# EAGLE schematic DELTA_7_25_2016 (EAGLE 6.3), part 2 of 2
## Sheet 8 of 13
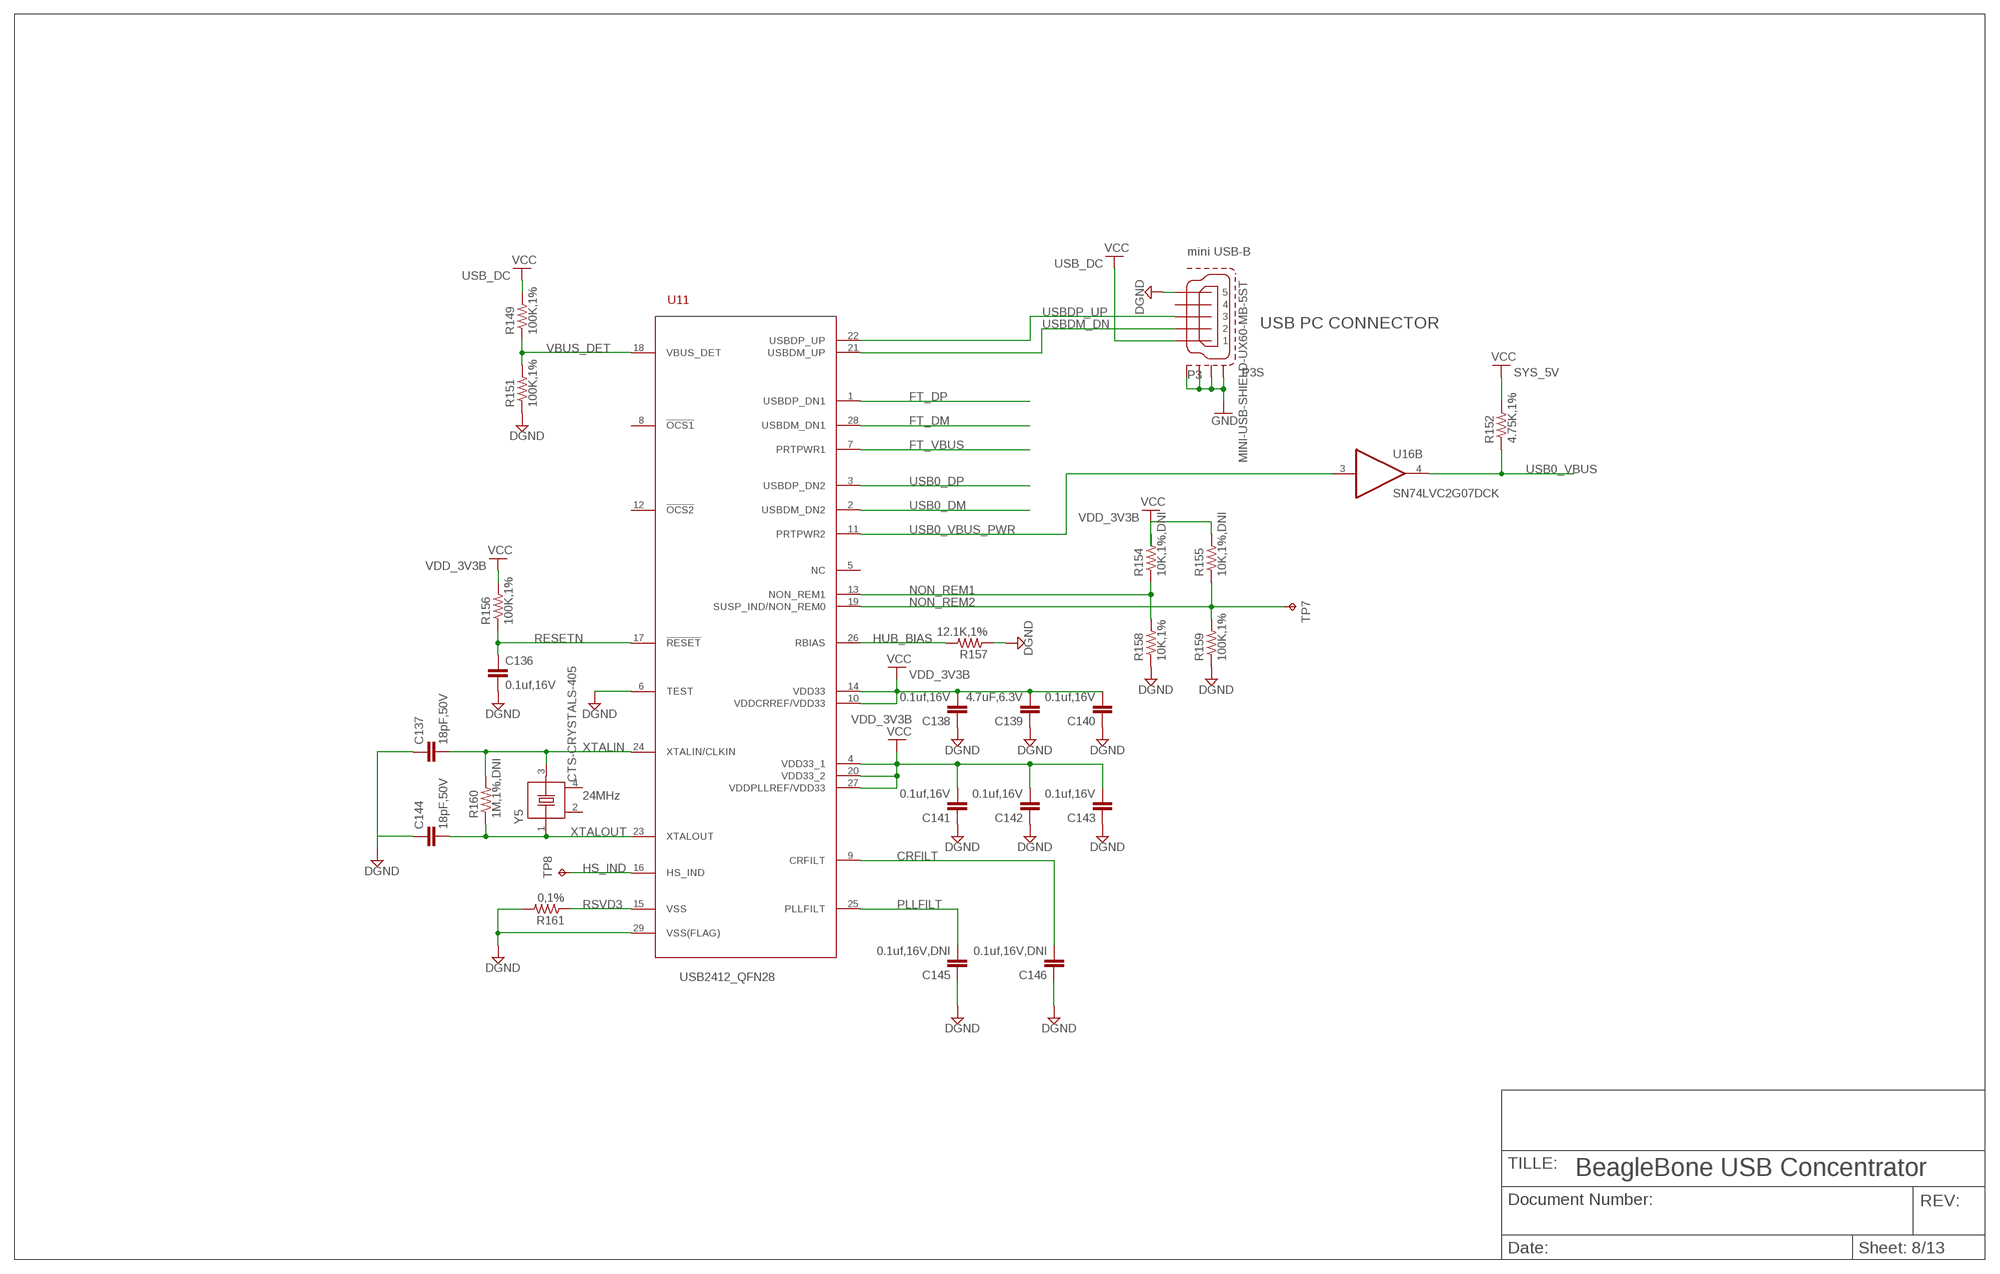
[diagram p9: schematic, sheet 8]

### Parts
C136  0.1uf,16V  CAPC402  [C402]
C137  18pF,50V  CAPC402  [C402]
C138  0.1uf,16V  CAPC402  [C402]
C139  4.7uF,6.3V  CAPC402  [C402]
C140  0.1uf,16V  CAPC402  [C402]
C141  0.1uf,16V  CAPC402  [C402]
C142  0.1uf,16V  CAPC402  [C402]
C143  0.1uf,16V  CAPC402  [C402]
C144  18pF,50V  CAPC402  [C402]
C145  0.1uf,16V,DNI  CAPC805  [C805]
C146  0.1uf,16V,DNI  CAPC805  [C805]
P3  MINI-USB-SHIELD-UX60-MB-5ST  [UX60-MB-5ST]
R149  100K,1%  R-US_R0402  [R0402]
R151  100K,1%  R-US_R0402  [R0402]
R152  4.75K,1%  R-US_R0402  [R0402]
R154  10K,1%,DNI  R-US_R0402  [R0402]
R155  10K,1%,DNI  R-US_R0402  [R0402]
R156  100K,1%  R-US_R0402  [R0402]
R157  12.1K,1%  R-US_R0402  [R0402]
R158  10K,1%  R-US_R0402  [R0402]
R159  100K,1%  R-US_R0402  [R0402]
R160  1M,1%,DNI  R-US_R0402  [R0402]
R161  0,1%  R-US_R0402  [R0402]
TP7  TPB1,27  [B1,27]
TP8  TPB1,27  [B1,27]
U11  USB2412_QFN28  [QFN28]
U16  SN74LVC2G07DCK  [DCK(R-PDSO-G6)]
Y5  CTS-CRYSTALS-405  [CTS-405]

### Nets
CRFILT: C146.2 U11.9(CRFILT)
DGND: C136.2 C137.1 C138.1 C139.1 C140.1 C141.1 C142.1 C143.1 C144.1 C145.1 C146.1 P3.5 R151.1 R157.1 R158.1 R159.1 R161.2 U11.6(TEST) U11.29(VSS(FLAG)) ; also sheet 1,2,3,5,6,7,9,10,11,12,13
FT_DM: U11.28(USBDM_DN1) ; also sheet 9
FT_DP: U11.1(USBDP_DN1) ; also sheet 9
FT_VBUS: U11.7(PRTPWR1) ; also sheet 9
GND: P3.M1(S1) P3.M2(S2) P3.M3(S3) P3.M4(S4) ; also sheet 1,7,10,11
HS_IND: TP8.TP U11.16(HS_IND)
HUB_BIAS: R157.2 U11.26(RBIAS)
NON_REM1: R154.1 R158.2 U11.13(NON_REM1)
NON_REM2: R155.1 R159.2 TP7.TP U11.19(SUSP_IND/NON_REM0)
PLLFILT: C145.2 U11.25(PLLFILT)
RESETN: C136.1 R156.1 U11.17(!RESET)
RSVD3: R161.1 U11.15(VSS)
SYS_5V: R152.2 ; supply symbol labelled VCC ; also sheet 1,5,7,10,11
USB0_DM: U11.2(USBDM_DN2) ; also sheet 4
USB0_DP: U11.3(USBDP_DN2) ; also sheet 4
USB0_VBUS: R152.1 U16.4(B:O) ; also sheet 4
USB0_VBUS_PWR: U11.11(PRTPWR2) U16.3(B:I)
USB_DC: P3.1 R149.2 ; supply symbol labelled VCC ; also sheet 1
USBDM_DN: P3.2 U11.21(USBDM_UP)
USBDP_UP: P3.3 U11.22(USBDP_UP)
VBUS_DET: R149.1 R151.2 U11.18(VBUS_DET)
VDD_3V3B: C138.2 C139.2 C140.2 C141.2 C142.2 C143.2 R155.2 R156.2 U11.4(VDD33_1) U11.10(VDDCRREF/VDD33) U11.14(VDD33) U11.20(VDD33_2) U11.27(VDDPLLREF/VDD33) ; supply symbol labelled VCC ; also sheet 1,4,6,7,9,10,11,13
XTALIN: C137.2 R160.2 U11.24(XTALIN/CLKIN) Y5.3
XTALOUT: C144.2 R160.1 U11.23(XTALOUT) Y5.1
Unconnected: P3.4 R154.2 U11.5(NC) U11.8(!OCS1) U11.12(!OCS2) Y5.2 Y5.4

### Notes on the sheet
- mini USB-B
- USB PC CONNECTOR
- 24MHz
- TILLE:
- BeagleBone USB Concentrator
- Document Number: | REV:
- Date: | Sheet: 8/13

## Sheet 9 of 13
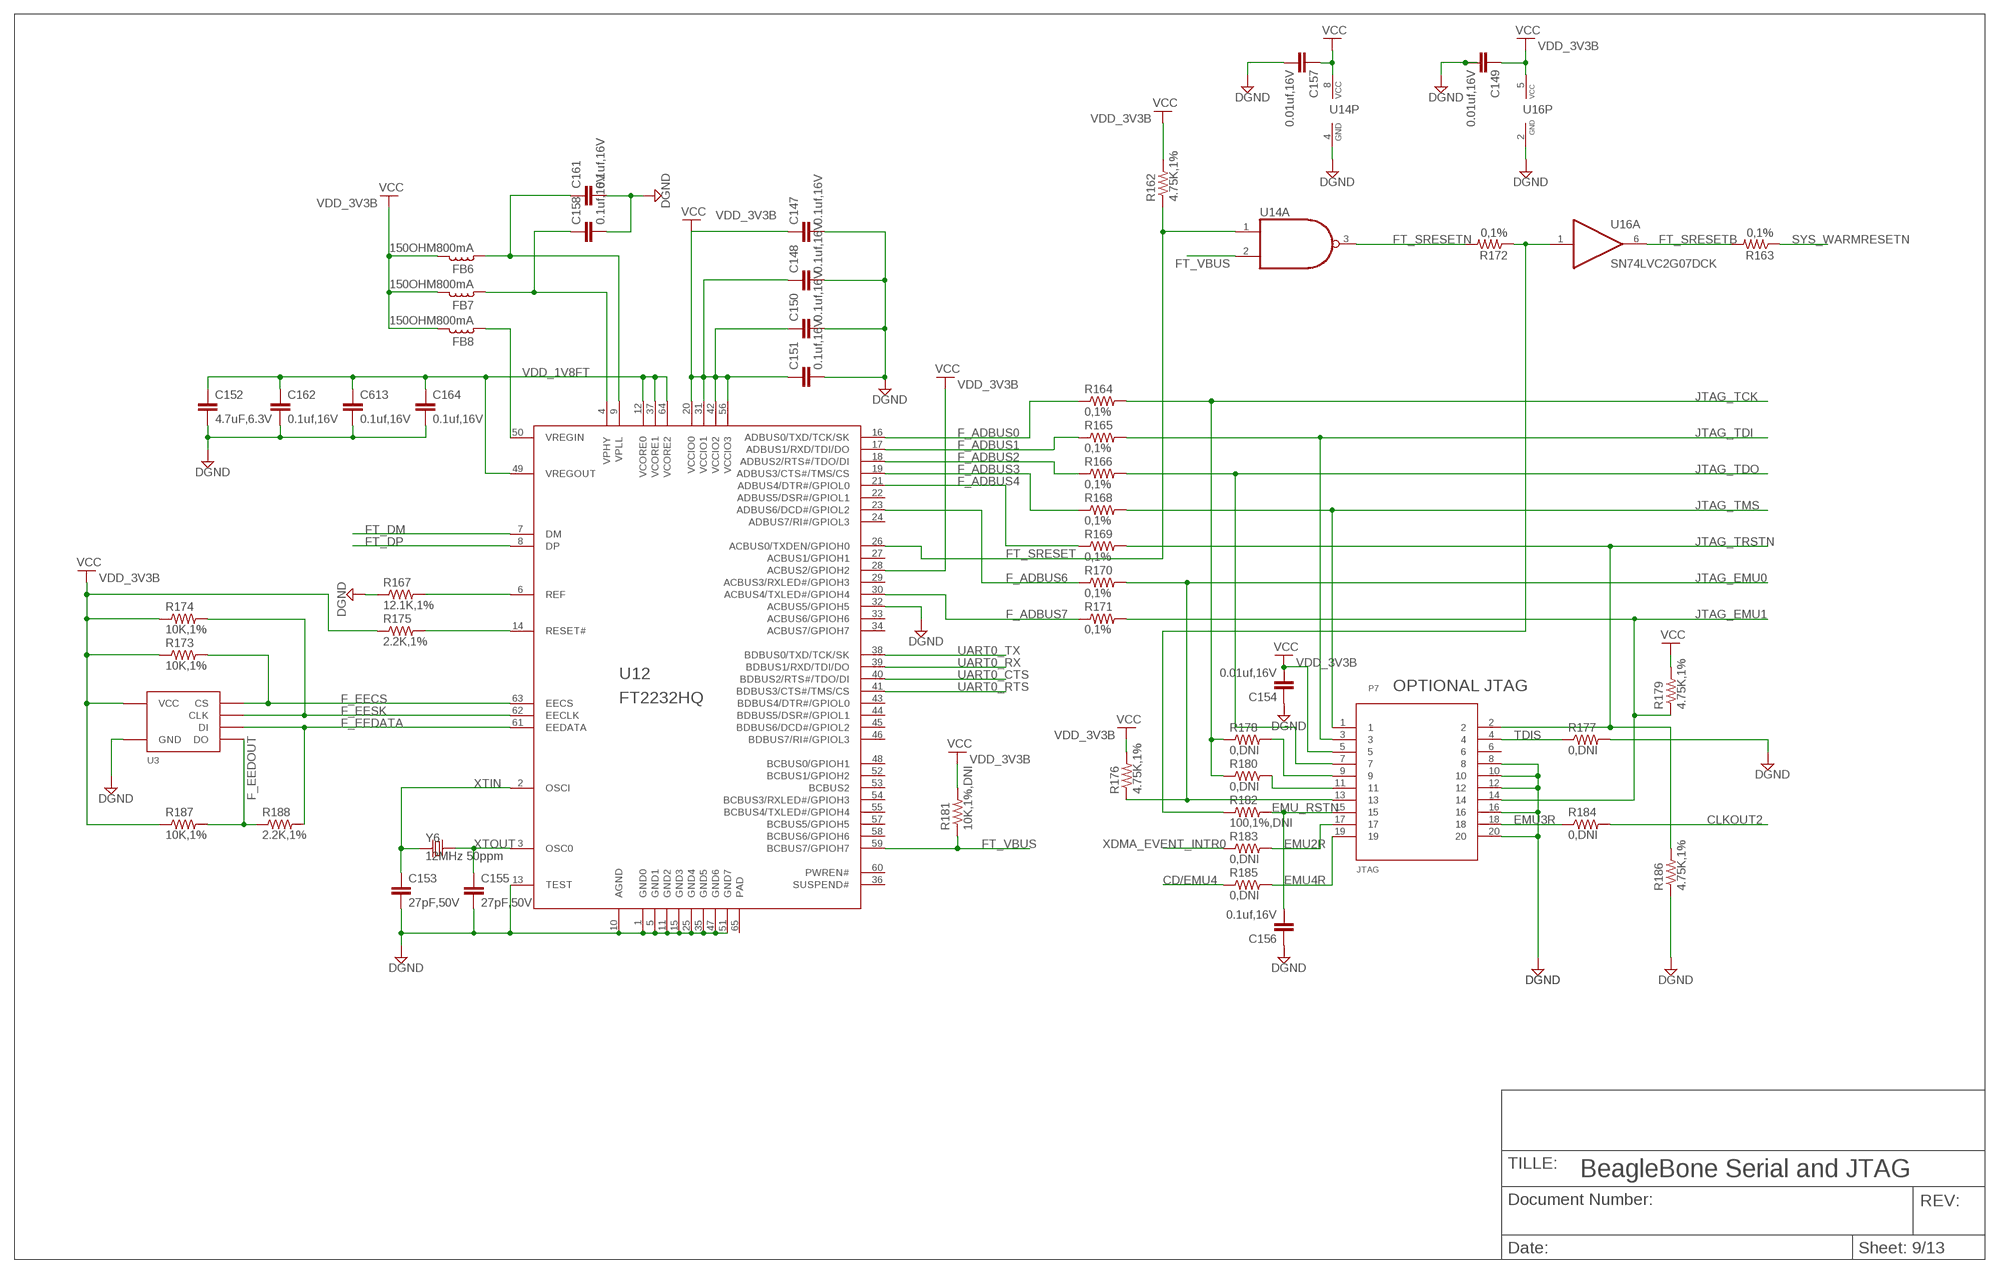
[diagram p10: schematic, sheet 9]

### Parts
C147  0.1uf,16V  CAPC402  [C402]
C148  0.1uf,16V  CAPC402  [C402]
C149  0.01uf,16V  CAPC402  [C402]
C150  0.1uf,16V  CAPC402  [C402]
C151  0.1uf,16V  CAPC402  [C402]
C152  4.7uF,6.3V  CAPC402  [C402]
C153  27pF,50V  CAPC402  [C402]
C154  0.01uf,16V  CAPC402  [C402]
C155  27pF,50V  CAPC402  [C402]
C156  0.1uf,16V  CAPC402  [C402]
C157  0.01uf,16V  CAPC402  [C402]
C158  0.1uf,16V  CAPC402  [C402]
C161  0.1uf,16V  CAPC402  [C402]
C162  0.1uf,16V  CAPC402  [C402]
C164  0.1uf,16V  CAPC402  [C402]
C613  0.1uf,16V  CAPC402  [C402]
FB6  150OHM800mA  L-USL0603  [L0603]
FB7  150OHM800mA  L-USL0603  [L0603]
FB8  150OHM800mA  L-USL0603  [L0603]
P7  JTAG  [MOLEX_79109-1004]
R162  4.75K,1%  R-US_R0402  [R0402]
R163  0,1%  R-US_R0402  [R0402]
R164  0,1%  R-US_R0402  [R0402]
R165  0,1%  R-US_R0402  [R0402]
R166  0,1%  R-US_R0402  [R0402]
R167  12.1K,1%  R-US_R0402  [R0402]
R168  0,1%  R-US_R0402  [R0402]
R169  0,1%  R-US_R0402  [R0402]
R170  0,1%  R-US_R0402  [R0402]
R171  0,1%  R-US_R0402  [R0402]
R172  0,1%  R-US_R0402  [R0402]
R173  10K,1%  R-US_R0402  [R0402]
R174  10K,1%  R-US_R0402  [R0402]
R175  2.2K,1%  R-US_R0402  [R0402]
R176  4.75K,1%  R-US_R0402  [R0402]
R177  0,DNI  R-US_R0402  [R0402]
R178  0,DNI  R-US_R0402  [R0402]
R179  4.75K,1%  R-US_R0402  [R0402]
R180  0,DNI  R-US_R0402  [R0402]
R181  10K,1%,DNI  R-US_R0402  [R0402]
R182  100,1%,DNI  R-US_R0402  [R0402]
R183  0,DNI  R-US_R0402  [R0402]
R184  0,DNI  R-US_R0402  [R0402]
R185  0,DNI  R-US_R0402  [R0402]
R186  4.75K,1%  R-US_R0402  [R0402]
R187  10K,1%  R-US_R0402  [R0402]
R188  2.2K,1%  R-US_R0402  [R0402]
U3  (EEPROM)93C46BT-I/OT  [SOT-23-6]
U12  FT2232HQ  FT2232H  [QFN64-HQ]
Y6  12MHz 50ppm  CRYSTAL_28M_  [5X8]

### Nets
CD/EMU4: R185.1 ; also sheet 4,10
CLKOUT2: R184.2 ; also sheet 3,10
DGND: C147.2 C148.2 C149.2 C150.2 C151.2 C152.2 C153.2 C154.1 C155.2 C156.1 C157.2 C158.2 C161.2 C162.2 C164.2 C613.2 P7.8 P7.10 P7.12 P7.16 P7.20 R167.1 R177.2 R186.1 U3.2(GND) U12.1(GND0) U12.5(GND1) U12.10(AGND) U12.11(GND2) U12.13(TEST) U12.15(GND3) U12.25(GND4) U12.32(ACBUS5/GPIOH5) U12.35(GND5) U12.47(GND6) U12.51(GND7) U14.4(P:GND) U16.2(P:GND) ; also sheet 1,2,3,5,6,7,8,10,11,12,13
EMU2R: P7.17 R183.2
EMU3R: P7.18 R184.1
EMU4R: P7.19 R185.2
EMU_RSTN: C156.2 P7.15 R182.2
F_ADBUS0: R164.1 U12.16(ADBUS0/TXD/TCK/SK)
F_ADBUS1: R165.1 U12.17(ADBUS1/RXD/TDI/DO)
F_ADBUS2: R166.1 U12.18(ADBUS2/RTS#/TDO/DI)
F_ADBUS3: R168.1 U12.19(ADBUS3/CTS#/TMS/CS)
F_ADBUS4: R169.1 U12.21(ADBUS4/DTR#/GPIOL0)
F_ADBUS6: R170.1 U12.23(ADBUS6/DCD#/GPIOL2)
F_ADBUS7: R171.1 U12.30(ACBUS4/TXLED#/GPIOH4)
F_EECS: R173.2 U3.5(CS) U12.63(EECS)
F_EEDATA: R188.2 U3.3(DI) U12.61(EEDATA)
F_EEDOUT: R187.2 R188.1 U3.1(DO)
F_EESK: R174.2 U3.4(CLK) U12.62(EECLK)
FT_DM: U12.7(DM) ; also sheet 8
FT_DP: U12.8(DP) ; also sheet 8
FT_SRESET: R162.1 U12.26(ACBUS0/TXDEN/GPIOH0) U14.1(A:I0)
FT_SRESETB: R163.2 U16.6(A:O)
FT_SRESETN: R172.2 U14.3(A:O)
FT_VBUS: R181.1 U12.59(BCBUS7/GPIOH7) U14.2(A:I1) ; also sheet 8
JTAG_EMU0: P7.13 R170.2 R176.1 ; also sheet 3
JTAG_EMU1: P7.14 R171.2 R179.1 ; also sheet 3
JTAG_TCK: R164.2 R178.1 R180.1 ; also sheet 3
JTAG_TDI: P7.3 R165.2 ; also sheet 3
JTAG_TDO: P7.7 R166.2 ; also sheet 3
JTAG_TMS: P7.1 R168.2 ; also sheet 3
JTAG_TRSTN: P7.2 R169.2 R186.2 ; also sheet 3
N$1: R167.2 U12.6(REF)
N$2: FB8.2 U12.50(VREGIN)
N$3: C158.1 FB7.2 U12.4(VPHY)
N$4: C161.1 FB6.2 U12.9(VPLL)
N$8: R175.2 U12.14(RESET#)
N$9: P7.11 R180.2
N$10: P7.9 R178.2
N$22: R172.1 R182.1 U16.1(A:I)
SYS_WARMRESETN: R163.1 ; also sheet 3,5
TDIS: P7.4 R177.1
UART0_CTS: U12.40(BDBUS2/RTS#/TDO/DI) ; also sheet 4
UART0_RTS: U12.41(BDBUS3/CTS#/TMS/CS) ; also sheet 4
UART0_RX: U12.39(BDBUS1/RXD/TDI/DO) ; also sheet 4
UART0_TX: U12.38(BDBUS0/TXD/TCK/SK) ; also sheet 4
VCC: R179.2 ; also sheet 7
VDD_1V8FT: C152.1 C162.1 C164.1 C613.1 U12.12(VCORE0) U12.37(VCORE1) U12.49(VREGOUT) U12.64(VCORE2)
VDD_3V3B: C147.1 C148.1 C149.1 C150.1 C151.1 C154.2 C157.1 FB6.1 FB7.1 FB8.1 P7.5 R162.2 R173.1 R174.1 R175.1 R176.2 R181.2 R187.1 U3.6(VCC) U12.20(VCCIO0) U12.28(ACBUS2/GPIOH2) U12.31(VCCIO1) U12.42(VCCIO2) U12.56(VCCIO3) U14.8(P:VCC) U16.5(P:VCC) ; supply symbol labelled VCC ; also sheet 1,4,6,7,8,10,11,13
XDMA_EVENT_INTR0: R183.1 ; also sheet 3
XTIN: C153.1 U12.2(OSCI) Y6.1(X1)
XTOUT: C155.1 U12.3(OSC0) Y6.2(X2)
Unconnected: P7.6 U12.22(ADBUS5/DSR#/GPIOL1) U12.24(ADBUS7/RI#/GPIOL3) U12.27(ACBUS1/GPIOH1) U12.29(ACBUS3/RXLED#/GPIOH3) U12.33(ACBUS6/GPIOH6) U12.34(ACBUS7/GPIOH7) U12.36(SUSPEND#) U12.43(BDBUS4/DTR#/GPIOL0) U12.44(BDBUS5/DSR#/GPIOL1) U12.45(BDBUS6/DCD#/GPIOL2) U12.46(BDBUS7/RI#/GPIOL3) U12.48(BCBUS0/GPIOH1) U12.52(BCBUS1/GPIOH2) U12.53(BCBUS2) U12.54(BCBUS3/RXLED#/GPIOH3) U12.55(BCBUS4/TXLED#/GPIOH4) U12.57(BCBUS5/GPIOH5) U12.58(BCBUS6/GPIOH6) U12.60(PWREN#) U12.65(PAD)

### Notes on the sheet
- OPTIONAL JTAG
- TILLE:
- BeagleBone Serial and JTAG
- Document Number: | REV:
- Date: | Sheet: 9/13

## Sheet 10 of 13
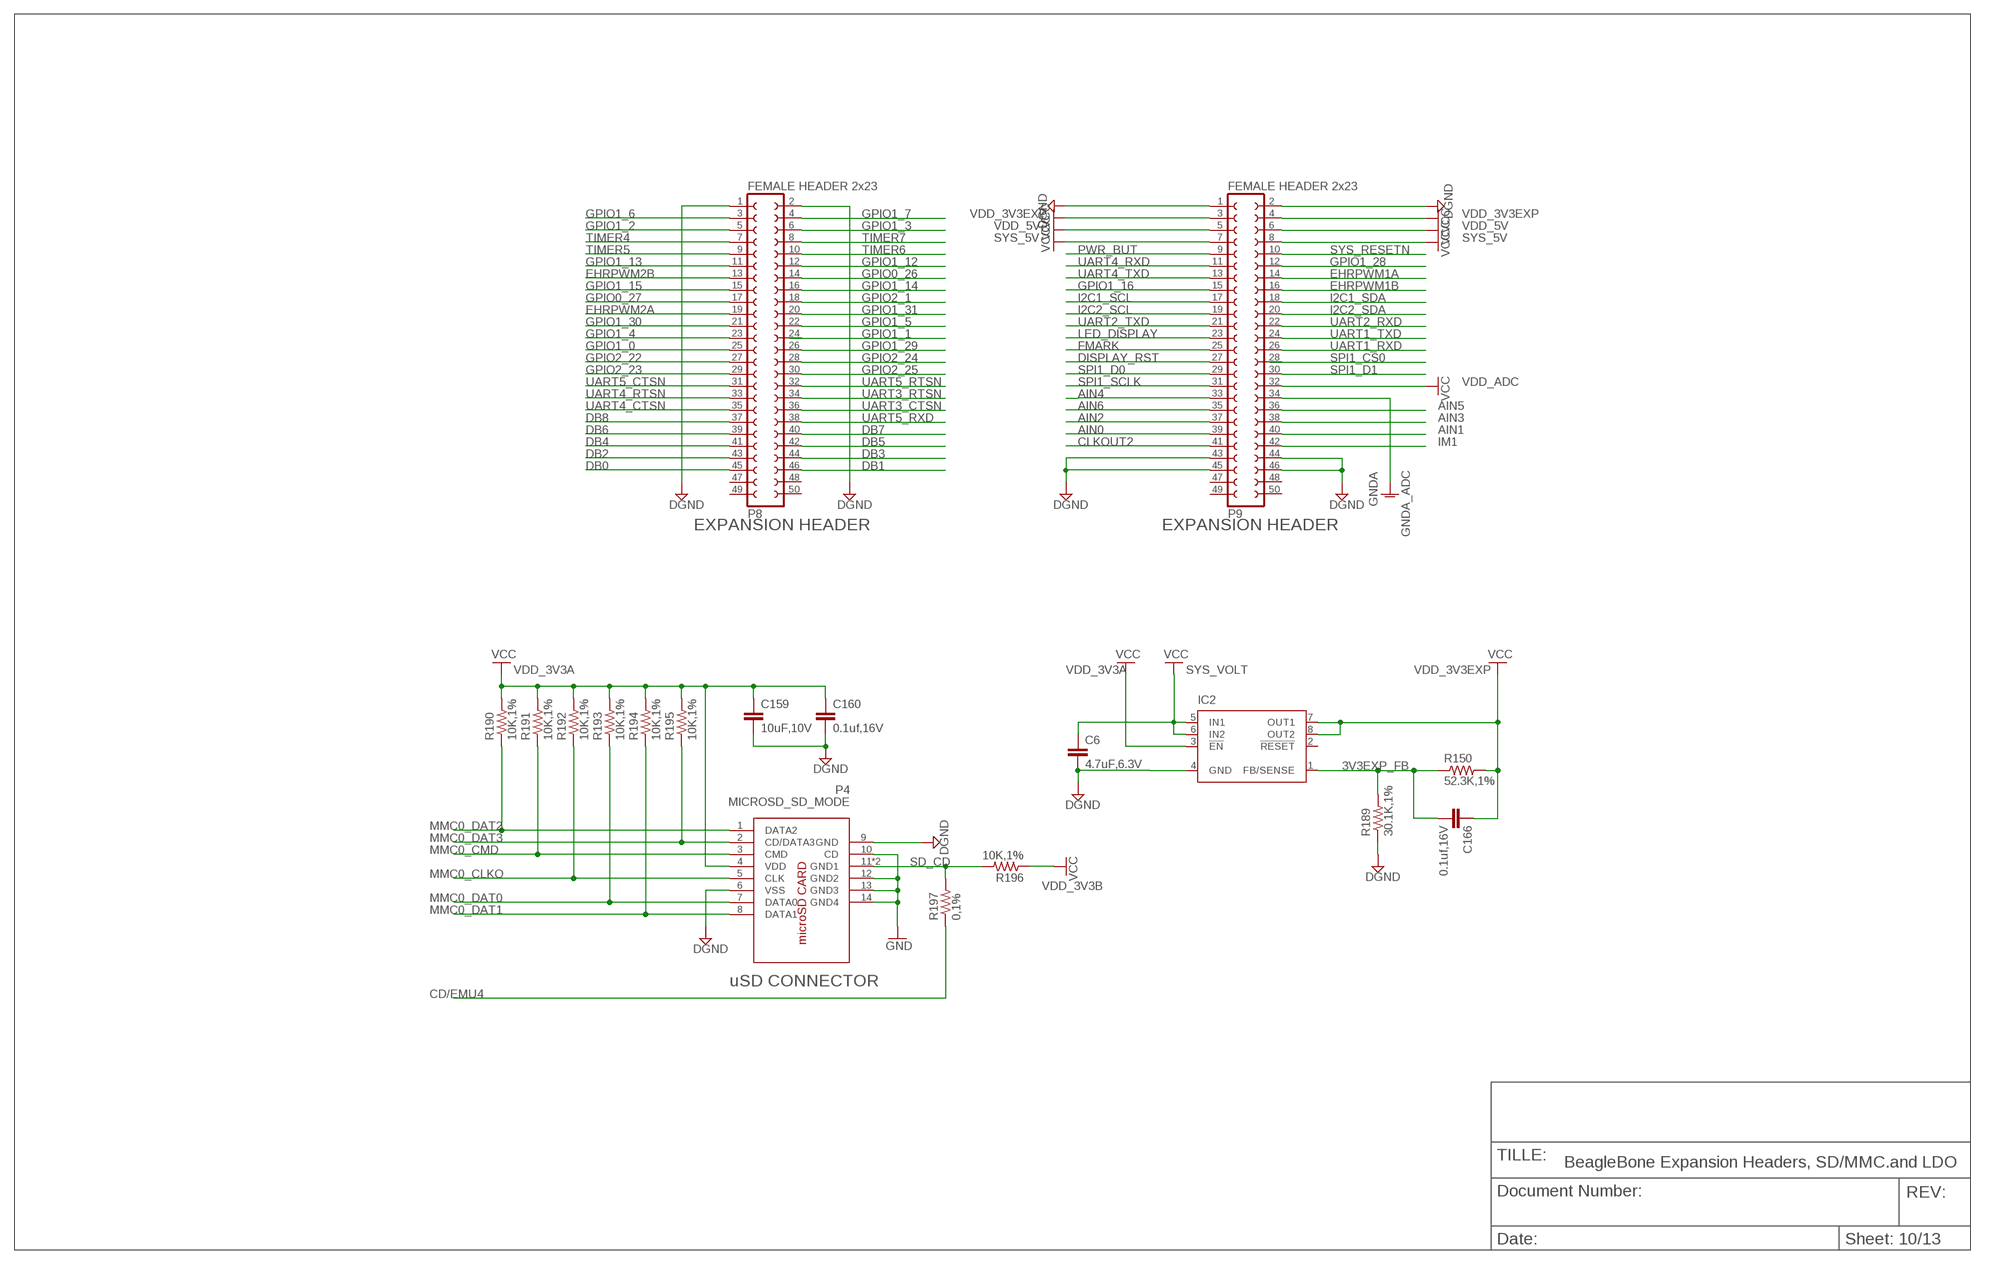
[diagram p11: schematic, sheet 10]

### Parts
C6  4.7uF,6.3V  C-EUC0402  [C0402]
C159  10uF,10V  C-EUC0402  [C0402]
C160  0.1uf,16V  C-EUC0402  [C0402]
C166  0.1uf,16V  C-EUC0402  [C0402]
IC2  TPS77301  [SOP-08]
P4  MICROSD_SD_MODE  [MICRO_SD_CONNECTOR]
P8  FEMALE HEADER 2x23  FE25-2  [FE25-2]
P9  FEMALE HEADER 2x23  FE25-2  [FE25-2]
R150  52.3K,1%  R-US_R0402  [R0402]
R189  30.1K,1%  R-US_R0402  [R0402]
R190  10K,1%  R-US_R0402  [R0402]
R191  10K,1%  R-US_R0402  [R0402]
R192  10K,1%  R-US_R0402  [R0402]
R193  10K,1%  R-US_R0402  [R0402]
R194  10K,1%  R-US_R0402  [R0402]
R195  10K,1%  R-US_R0402  [R0402]
R196  10K,1%  R-US_R0402  [R0402]
R197  0,1%  R-US_R0402  [R0402]

### Nets
3V3EXP_FB: C166.2 IC2.1(FB/SENSE) R150.1 R189.2
AIN0: P9.39 ; also sheet 4
AIN1: P9.40 ; also sheet 4
AIN2: P9.37 ; also sheet 4
AIN3: P9.38 ; also sheet 4
AIN4: P9.33 ; also sheet 4
AIN5: P9.36 ; also sheet 4
AIN6: P9.35 ; also sheet 4
CD/EMU4: R197.1 ; also sheet 4,9
CLKOUT2: P9.41 ; also sheet 3,9
DB0: P8.45 ; also sheet 4,13
DB1: P8.46 ; also sheet 4,13
DB2: P8.43 ; also sheet 4,13
DB3: P8.44 ; also sheet 4,13
DB4: P8.41 ; also sheet 4,13
DB5: P8.42 ; also sheet 4,13
DB6: P8.39 ; also sheet 4,13
DB7: P8.40 ; also sheet 4,13
DB8: P8.37 ; also sheet 4,13
DGND: C6.2 C159.2 C160.2 IC2.4(GND) P4.6(VSS) P4.9(GND) P8.1 P8.2 P9.1 P9.2 P9.43 P9.44 P9.45 P9.46 R189.1 ; also sheet 1,2,3,5,6,7,8,9,11,12,13
DISPLAY_RST: P9.27 ; also sheet 4,13
EHRPWM1A: P9.14 ; also sheet 3
EHRPWM1B: P9.16 ; also sheet 3
EHRPWM2A: P8.19 ; also sheet 3
EHRPWM2B: P8.13 ; also sheet 3
FMARK: P9.25 ; also sheet 4,13
GND: P4.10(CD) P4.12(GND2) P4.13(GND3) P4.14(GND4) ; also sheet 1,7,8,11
GNDA_ADC: P9.34 ; supply symbol labelled GNDA
GPIO0_26: P8.14 ; also sheet 3
GPIO0_27: P8.17 ; also sheet 3
GPIO1_0: P8.25 ; also sheet 3
GPIO1_2: P8.5 ; also sheet 3
GPIO1_3: P8.6 ; also sheet 3
GPIO1_4: P8.23 ; also sheet 3
GPIO1_5: P8.22 ; also sheet 3
GPIO1_6: P8.3 ; also sheet 3
GPIO1_7: P8.4 ; also sheet 3
GPIO1_12: P8.12 ; also sheet 3
GPIO1_13: P8.11 ; also sheet 3
GPIO1_14: P8.16 ; also sheet 3
GPIO1_15: P8.15 ; also sheet 3
GPIO1_16: P9.15 ; also sheet 3
GPIO1_28: P9.12 ; also sheet 3
GPIO1_29: P8.26 ; also sheet 3
GPIO1_30: P8.21 ; also sheet 3
GPIO1_31: P8.20 ; also sheet 3
GPIO2_1: P8.18 ; also sheet 3
GPIO2_22: P8.27 ; also sheet 4
GPIO2_23: P8.29 ; also sheet 4
GPIO2_24: P8.28 ; also sheet 4
GPIO2_25: P8.30 ; also sheet 4
I2C1_SCL: P9.17 ; also sheet 4,13
I2C1_SDA: P9.18 ; also sheet 4,13
I2C2_SCL: P9.19 ; also sheet 4
I2C2_SDA: P9.20 ; also sheet 4
IM1: P9.42 ; also sheet 4,13
LED_DISPLAY: P9.23 ; also sheet 3,13
MMC0_CLKO: P4.5(CLK) R192.1 ; also sheet 3
MMC0_CMD: P4.3(CMD) R191.1 ; also sheet 3
MMC0_DAT0: P4.7(DATA0) R193.1 ; also sheet 3
MMC0_DAT1: P4.8(DATA1) R194.1 ; also sheet 3
MMC0_DAT2: P4.1(DATA2) R190.1 ; also sheet 3
MMC0_DAT3: P4.2(CD/DATA3) R195.1 ; also sheet 3
PWR_BUT: P9.9 ; also sheet 1
SD_CD: P4.11(GND1) P4.15(GND1) R196.2 R197.2
SPI1_D0: P9.29 ; also sheet 4,11,13
SPI1_D1: P9.30 ; also sheet 4,13
SPI1_SCLK: P9.31 ; also sheet 4,11,13
SYS_5V: P9.7 P9.8 ; supply symbol labelled VCC ; also sheet 1,5,7,8,11
SYS_RESETN: P9.10 ; also sheet 3,7
SYS_VOLT: C6.1 IC2.5(IN1) IC2.6(IN2) ; supply symbol labelled VCC ; also sheet 1
TIMER4: P8.7 ; also sheet 3
TIMER5: P8.9 ; also sheet 3
TIMER6: P8.10 ; also sheet 3
TIMER7: P8.8 ; also sheet 3
UART1_RXD: P9.26 ; also sheet 4
UART1_TXD: P9.24 ; also sheet 4
UART2_RXD: P9.22 ; also sheet 4
UART2_TXD: P9.21 ; also sheet 4
UART3_CTSN: P8.36 ; also sheet 4
UART3_RTSN: P8.34 ; also sheet 4
UART4_CTSN: P8.35 ; also sheet 4
UART4_RTSN: P8.33 ; also sheet 4
UART4_RXD: P9.11 ; also sheet 3
UART4_TXD: P9.13 ; also sheet 3
UART5_CTSN: P8.31 ; also sheet 4
UART5_RTSN: P8.32 ; also sheet 4
UART5_RXD: P8.38 ; also sheet 4
VDD_3V3A: C159.1 C160.1 IC2.3(!EN) P4.4(VDD) R190.2 R191.2 R192.2 R193.2 R194.2 R195.2 ; supply symbol labelled VCC ; also sheet 1,2,3,5
VDD_3V3B: R196.1 ; supply symbol labelled VCC ; also sheet 1,4,6,7,8,9,11,13
VDD_3V3EXP: C166.1 IC2.7(OUT1) IC2.8(OUT2) P9.3 P9.4 R150.2 ; supply symbol labelled VCC
VDD_5V: P9.5 P9.6 ; supply symbol labelled VCC ; also sheet 1
VDD_ADC: P9.32 ; supply symbol labelled VCC ; also sheet 2,4
Unconnected: IC2.2(!RESET) P8.24 P8.47 P8.48 P8.49 P8.50 P9.28 P9.47 P9.48 P9.49 P9.50

### Notes on the sheet
- EXPANSION HEADER | EXPANSION HEADER
- uSD CONNECTOR
- TILLE:
- BeagleBone Expansion Headers, SD/MMC.and LDO
- Document Number: | REV:
- Date: | Sheet: 10/13

## Sheet 11 of 13
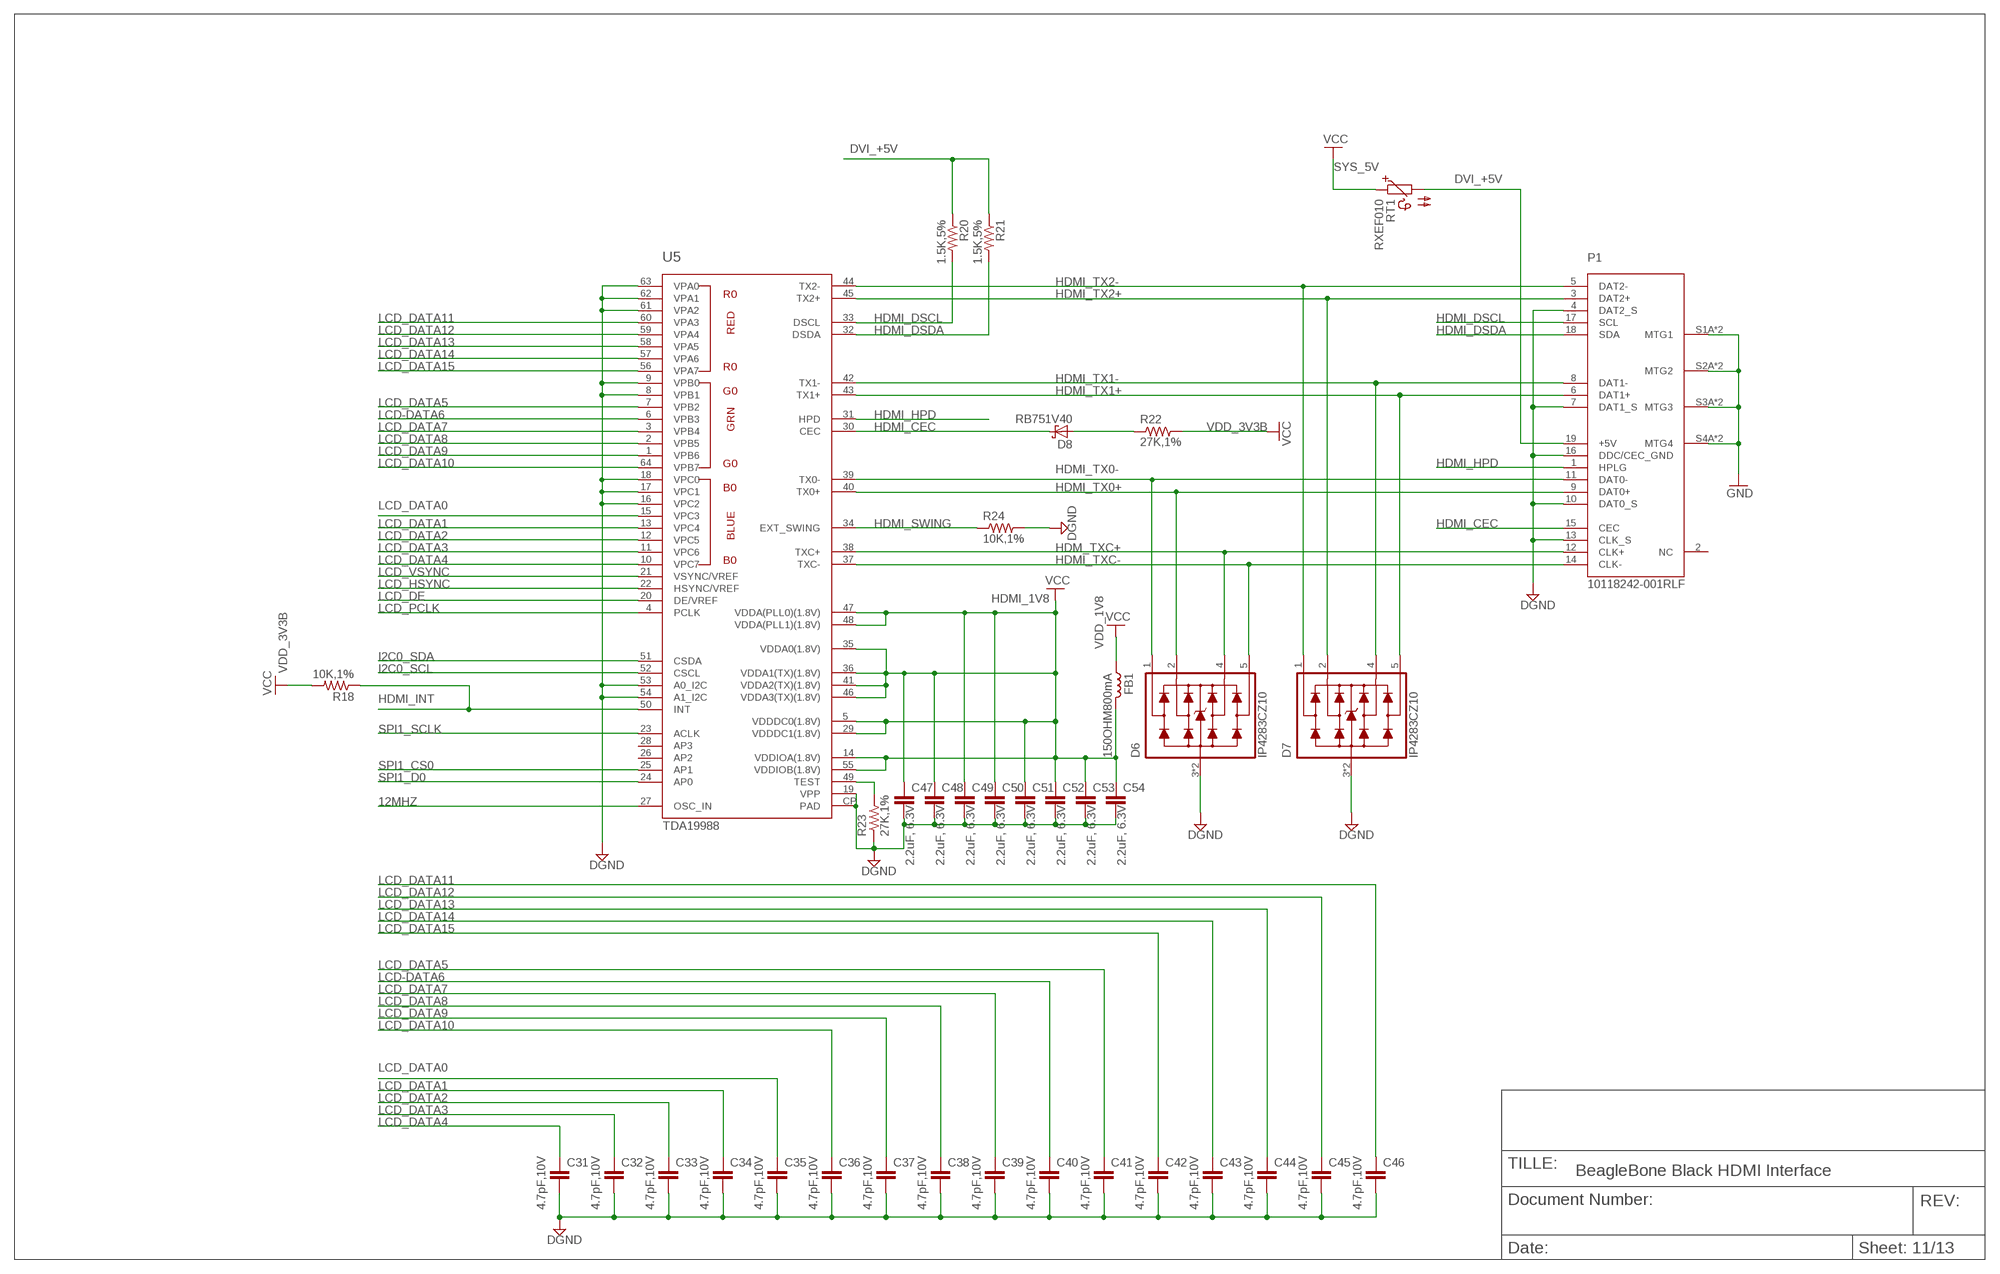
[diagram p12: schematic, sheet 11]

### Parts
C31  4.7pF,10V  C-EUC0402  [C0402]
C32  4.7pF,10V  C-EUC0402  [C0402]
C33  4.7pF,10V  C-EUC0402  [C0402]
C34  4.7pF,10V  C-EUC0402  [C0402]
C35  4.7pF,10V  C-EUC0402  [C0402]
C36  4.7pF,10V  C-EUC0402  [C0402]
C37  4.7pF,10V  C-EUC0402  [C0402]
C38  4.7pF,10V  C-EUC0402  [C0402]
C39  4.7pF,10V  C-EUC0402  [C0402]
C40  4.7pF,10V  C-EUC0402  [C0402]
C41  4.7pF,10V  C-EUC0402  [C0402]
C42  4.7pF,10V  C-EUC0402  [C0402]
C43  4.7pF,10V  C-EUC0402  [C0402]
C44  4.7pF,10V  C-EUC0402  [C0402]
C45  4.7pF,10V  C-EUC0402  [C0402]
C46  4.7pF,10V  C-EUC0402  [C0402]
C47  2.2uF, 6.3V  C-EUC0402  [C0402]
C48  2.2uF, 6.3V  C-EUC0402  [C0402]
C49  2.2uF, 6.3V  C-EUC0402  [C0402]
C50  2.2uF, 6.3V  C-EUC0402  [C0402]
C51  2.2uF, 6.3V  C-EUC0402  [C0402]
C52  2.2uF, 6.3V  C-EUC0402  [C0402]
C53  2.2uF, 6.3V  C-EUC0402  [C0402]
C54  2.2uF, 6.3V  C-EUC0402  [C0402]
D6  IP4283CZ10  [DFN2510A-10(SOT1176-1)]
D7  IP4283CZ10  [DFN2510A-10(SOT1176-1)]
D8  RB751V40  [SOD323(F)]
FB1  150OHM800mA  L-USL0603  [L0603]
P1  10118242-001RLF  [10118242]
R18  10K,1%  R-US_R0402  [R0402]
R20  1.5K,5%  R-US_R0402  [R0402]
R21  1.5K,5%  R-US_R0402  [R0402]
R22  27K,1%  R-US_R0402  [R0402]
R23  27K,1%  R-US_R0402  [R0402]
R24  10K,1%  R-US_R0402  [R0402]
RT1  RXEF010  PTC660A  [P660A]
U5  TDA19988  TDA19988BHN/C1,557  [SOT804-4]

### Nets
12MHZ: U5.27(OSC_IN)
DGND: C31.2 C32.2 C33.2 C34.2 C35.2 C36.2 C37.2 C38.2 C39.2 C40.2 C41.2 C42.2 C43.2 C44.2 C45.2 C46.2 C47.2 C48.2 C49.2 C50.2 C51.2 C52.2 C53.2 C54.2 D6.3(G) D6.8(G) D7.3(G) D7.8(G) P1.4(DAT2_S) P1.7(DAT1_S) P1.10(DAT0_S) P1.13(CLK_S) P1.16(DDC/CEC_GND) R23.1 R24.2 U5.8(VPB1) U5.9(VPB0) U5.16(VPC2) U5.17(VPC1) U5.18(VPC0) U5.19(VPP) U5.53(A0_I2C) U5.54(A1_I2C) U5.61(VPA2) U5.62(VPA1) U5.63(VPA0) U5.CP(PAD) ; also sheet 1,2,3,5,6,7,8,9,10,12,13
DVI_+5V: P1.19(+5V) R20.1 R21.1 RT1.2
GND: P1.S1A(MTG1) P1.S1B(MTG1) P1.S2A(MTG2) P1.S2B(MTG2) P1.S3A(MTG3) P1.S3B(MTG3) P1.S4A(MTG4) P1.S4B(MTG4) ; also sheet 1,7,8,10
HDM_TXC+: D6.4 P1.12(CLK+) U5.38(TXC+)
HDMI_1V8: C47.1 C48.1 C49.1 C50.1 C51.1 C52.1 C53.1 C54.1 FB1.1 U5.5(VDDDC0(1.8V)) U5.14(VDDIOA(1.8V)) U5.29(VDDDC1(1.8V)) U5.35(VDDA0(1.8V)) U5.36(VDDA1(TX)(1.8V)) U5.41(VDDA2(TX)(1.8V)) U5.46(VDDA3(TX)(1.8V)) U5.47(VDDA(PLL0)(1.8V)) U5.48(VDDA(PLL1)(1.8V)) U5.55(VDDIOB(1.8V)) ; supply symbol labelled VCC
HDMI_CEC: D8.1(K) P1.15(CEC) U5.30(CEC)
HDMI_DSCL: P1.17(SCL) R20.2 U5.33(DSCL)
HDMI_DSDA: P1.18(SDA) R21.2 U5.32(DSDA)
HDMI_HPD: P1.1(HPLG) U5.31(HPD)
HDMI_INT: R18.1 U5.50(INT)
HDMI_SWING: R24.1 U5.34(EXT_SWING)
HDMI_TX0+: D6.2 P1.9(DAT0+) U5.40(TX0+)
HDMI_TX0-: D6.1 P1.11(DAT0-) U5.39(TX0-)
HDMI_TX1+: D7.5 P1.6(DAT1+) U5.43(TX1+)
HDMI_TX1-: D7.4 P1.8(DAT1-) U5.42(TX1-)
HDMI_TX2+: D7.2 P1.3(DAT2+) U5.45(TX2+)
HDMI_TX2-: D7.1 P1.5(DAT2-) U5.44(TX2-)
HDMI_TXC-: D6.5 P1.14(CLK-) U5.37(TXC-)
I2C0_SCL: U5.52(CSCL) ; also sheet 1,4,6
I2C0_SDA: U5.51(CSDA) ; also sheet 1,4,6
LCD-DATA6: C40.1 U5.6(VPB3)
LCD_DATA0: C35.1 U5.15(VPC3)
LCD_DATA1: C34.1 U5.13(VPC4)
LCD_DATA2: C33.1 U5.12(VPC5)
LCD_DATA3: C32.1 U5.11(VPC6)
LCD_DATA4: C31.1 U5.10(VPC7)
LCD_DATA5: C41.1 U5.7(VPB2)
LCD_DATA7: C39.1 U5.3(VPB4)
LCD_DATA8: C38.1 U5.2(VPB5)
LCD_DATA9: C37.1 U5.1(VPB6)
LCD_DATA10: C36.1 U5.64(VPB7)
LCD_DATA11: C46.1 U5.60(VPA3)
LCD_DATA12: C45.1 U5.59(VPA4)
LCD_DATA13: C44.1 U5.58(VPA5)
LCD_DATA14: C43.1 U5.57(VPA6)
LCD_DATA15: C42.1 U5.56(VPA7)
LCD_DE: U5.20(DE/VREF)
LCD_HSYNC: U5.22(HSYNC/VREF)
LCD_PCLK: U5.4(PCLK)
LCD_VSYNC: U5.21(VSYNC/VREF)
N$5: R23.2 U5.49(TEST)
N$25: D8.2(A) R22.1
SPI1_CS0: U5.25(AP1) ; also sheet 4,10,13
SPI1_D0: U5.24(AP0) ; also sheet 4,10,13
SPI1_SCLK: U5.23(ACLK) ; also sheet 4,10,13
SYS_5V: RT1.1 ; supply symbol labelled VCC ; also sheet 1,5,7,8,10
VDD_1V8: FB1.2 ; supply symbol labelled VCC ; also sheet 1,2
VDD_3V3B: R18.2 R22.2 ; supply symbol labelled VCC ; also sheet 1,4,6,7,8,9,10,13
Unconnected: P1.2(NC) U5.26(AP2) U5.28(AP3)

### Notes on the sheet
- TILLE:
- BeagleBone Black HDMI Interface
- Document Number: | REV:
- Date: | Sheet: 11/13

## Sheet 12 of 13
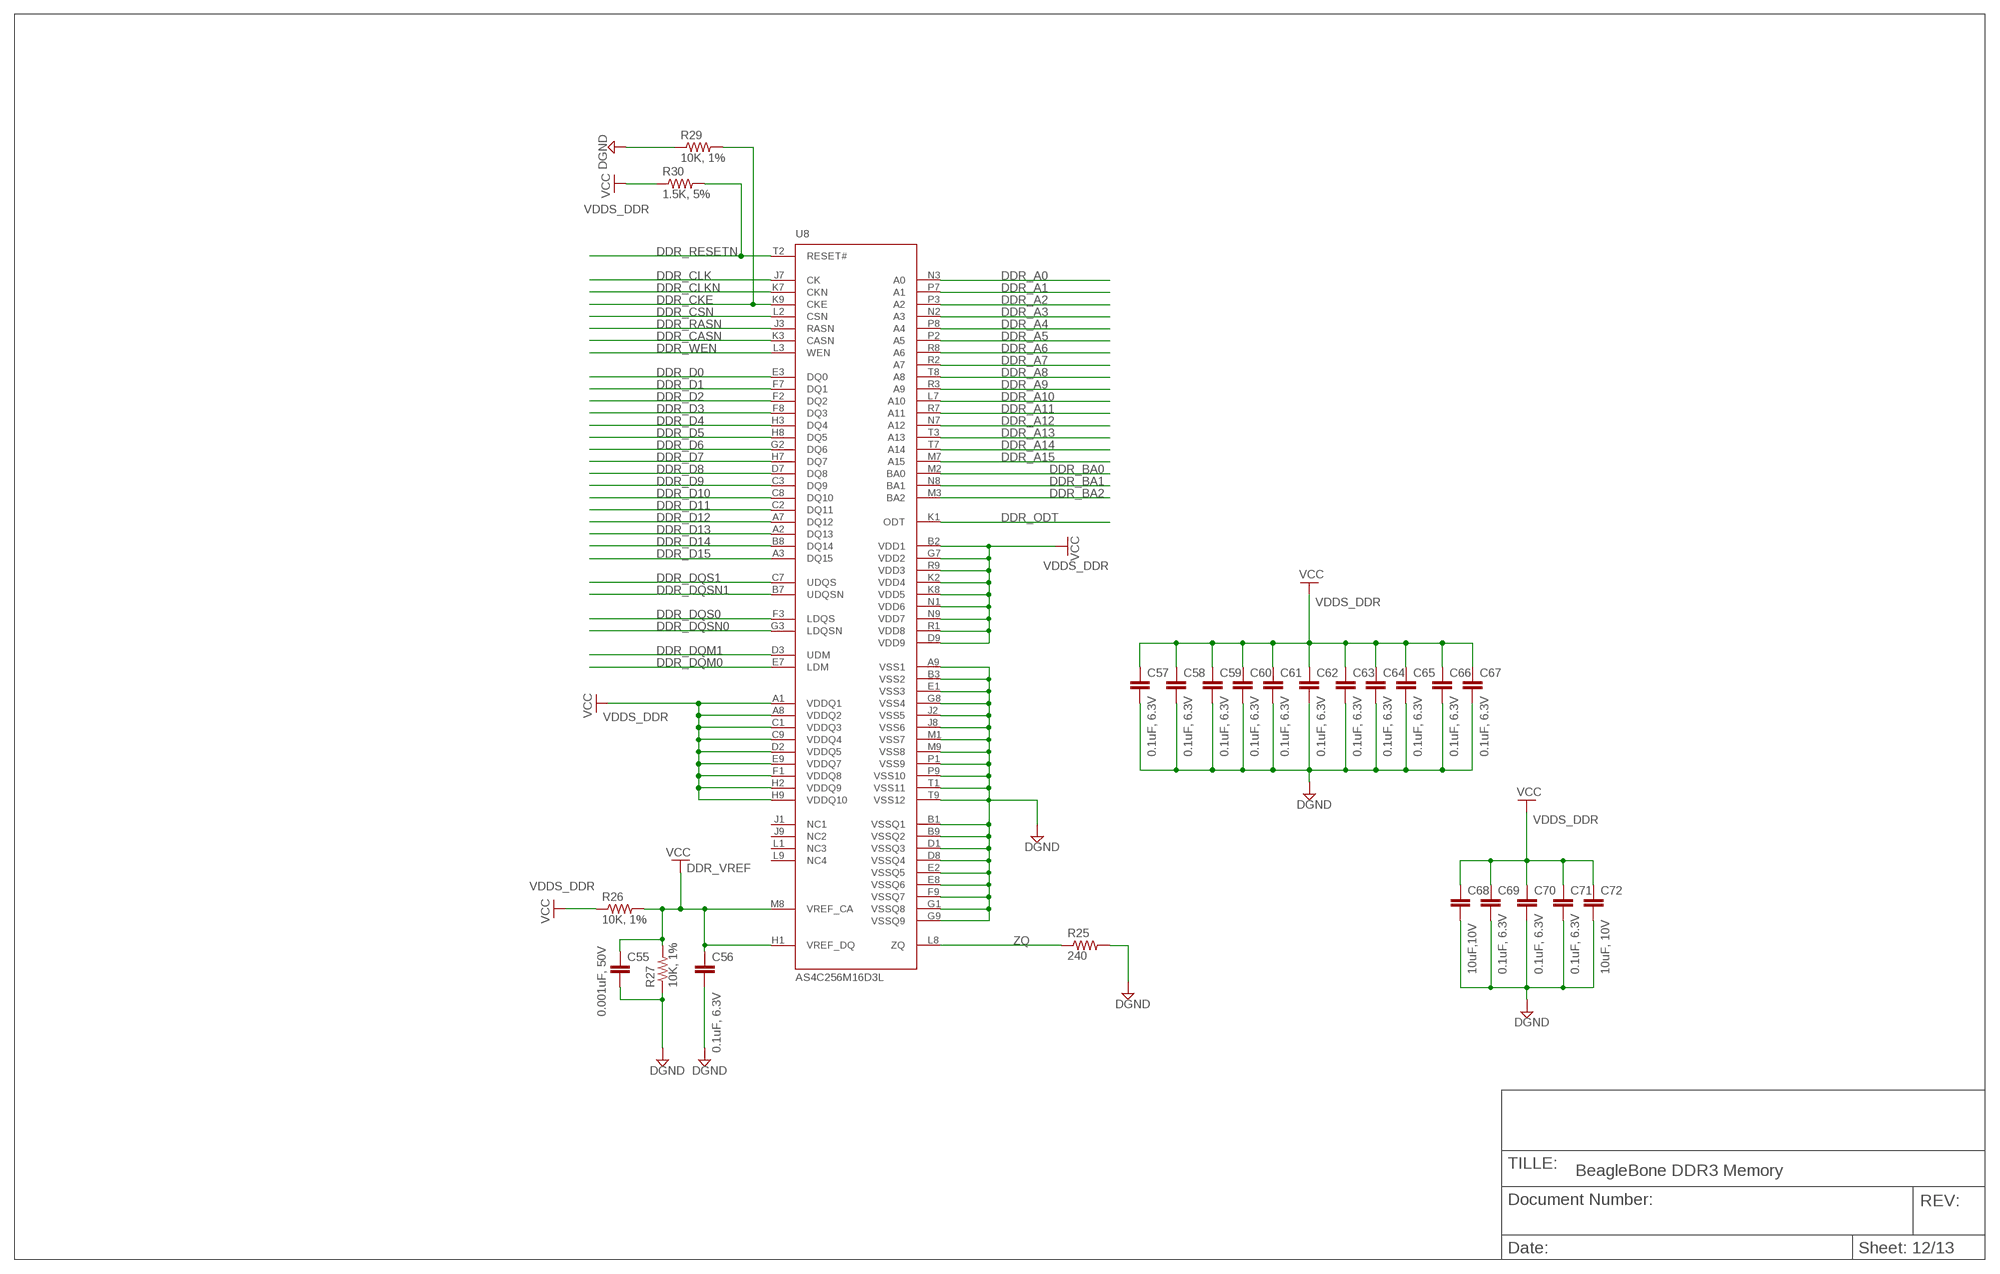
[diagram p13: schematic, sheet 12]

### Parts
C55  0.001uF, 50V  C-EUC0402  [C0402]
C56  0.1uF, 6.3V  C-EUC0402  [C0402]
C57  0.1uF, 6.3V  C-EUC0402  [C0402]
C58  0.1uF, 6.3V  C-EUC0402  [C0402]
C59  0.1uF, 6.3V  C-EUC0402  [C0402]
C60  0.1uF, 6.3V  C-EUC0402  [C0402]
C61  0.1uF, 6.3V  C-EUC0402  [C0402]
C62  0.1uF, 6.3V  C-EUC0402  [C0402]
C63  0.1uF, 6.3V  C-EUC0402  [C0402]
C64  0.1uF, 6.3V  C-EUC0402  [C0402]
C65  0.1uF, 6.3V  C-EUC0402  [C0402]
C66  0.1uF, 6.3V  C-EUC0402  [C0402]
C67  0.1uF, 6.3V  C-EUC0402  [C0402]
C68  10uF,10V  C-EUC0402  [C0402]
C69  0.1uF, 6.3V  C-EUC0402  [C0402]
C70  0.1uF, 6.3V  C-EUC0402  [C0402]
C71  0.1uF, 6.3V  C-EUC0402  [C0402]
C72  10uF, 10V  C-EUC0402  [C0402]
R25  240  R-US_R0402  [R0402]
R26  10K, 1%  R-US_R0402  [R0402]
R27  10K, 1%  R-US_R0402  [R0402]
R29  10K, 1%  R-US_R0402  [R0402]
R30  1.5K, 5%  R-US_R0402  [R0402]
U8  AS4C256M16D3L  [96FBGA]

### Nets
DDR_A0: U8.N3(A0) ; also sheet 3,6
DDR_A1: U8.P7(A1) ; also sheet 3,6
DDR_A2: U8.P3(A2) ; also sheet 3,6
DDR_A3: U8.N2(A3) ; also sheet 3,6
DDR_A4: U8.P8(A4) ; also sheet 3,6
DDR_A5: U8.P2(A5) ; also sheet 3,6
DDR_A6: U8.R8(A6) ; also sheet 3,6
DDR_A7: U8.R2(A7) ; also sheet 3,6
DDR_A8: U8.T8(A8) ; also sheet 3,6
DDR_A9: U8.R3(A9) ; also sheet 3,6
DDR_A10: U8.L7(A10) ; also sheet 3,6
DDR_A11: U8.R7(A11) ; also sheet 3,6
DDR_A12: U8.N7(A12) ; also sheet 3,6
DDR_A13: U8.T3(A13) ; also sheet 3,6
DDR_A14: U8.T7(A14)
DDR_A15: U8.M7(A15)
DDR_BA0: U8.M2(BA0) ; also sheet 3,6
DDR_BA1: U8.N8(BA1) ; also sheet 3,6
DDR_BA2: U8.M3(BA2) ; also sheet 3,6
DDR_CASN: U8.K3(CASN) ; also sheet 3,6
DDR_CKE: R29.2 U8.K9(CKE) ; also sheet 3,6
DDR_CLK: U8.J7(CK) ; also sheet 3,6
DDR_CLKN: U8.K7(CKN) ; also sheet 3,6
DDR_CSN: U8.L2(CSN) ; also sheet 3,6
DDR_D0: U8.E3(DQ0) ; also sheet 3,6
DDR_D1: U8.F7(DQ1) ; also sheet 3,6
DDR_D2: U8.F2(DQ2) ; also sheet 3,6
DDR_D3: U8.F8(DQ3) ; also sheet 3,6
DDR_D4: U8.H3(DQ4) ; also sheet 3,6
DDR_D5: U8.H8(DQ5) ; also sheet 3,6
DDR_D6: U8.G2(DQ6) ; also sheet 3,6
DDR_D7: U8.H7(DQ7) ; also sheet 3,6
DDR_D8: U8.D7(DQ8) ; also sheet 3,6
DDR_D9: U8.C3(DQ9) ; also sheet 3,6
DDR_D10: U8.C8(DQ10) ; also sheet 3,6
DDR_D11: U8.C2(DQ11) ; also sheet 3,6
DDR_D12: U8.A7(DQ12) ; also sheet 3,6
DDR_D13: U8.A2(DQ13) ; also sheet 3,6
DDR_D14: U8.B8(DQ14) ; also sheet 3,6
DDR_D15: U8.A3(DQ15) ; also sheet 3,6
DDR_DQM0: U8.E7(LDM) ; also sheet 3,6
DDR_DQM1: U8.D3(UDM) ; also sheet 3,6
DDR_DQS0: U8.F3(LDQS) ; also sheet 3,6
DDR_DQS1: U8.C7(UDQS) ; also sheet 3,6
DDR_DQSN0: U8.G3(LDQSN) ; also sheet 3,6
DDR_DQSN1: U8.B7(UDQSN) ; also sheet 3,6
DDR_ODT: U8.K1(ODT) ; also sheet 3,6
DDR_RASN: U8.J3(RASN) ; also sheet 3,6
DDR_RESETN: R30.2 U8.T2(RESET#) ; also sheet 3
DDR_VREF: C55.1 C56.1 R26.2 R27.2 U8.H1(VREF_DQ) U8.M8(VREF_CA) ; supply symbol labelled VCC ; also sheet 3,6
DDR_WEN: U8.L3(WEN) ; also sheet 3,6
DGND: C55.2 C56.2 C57.2 C58.2 C59.2 C60.2 C61.2 C62.2 C63.2 C64.2 C65.2 C66.2 C67.2 C68.2 C69.2 C70.2 C71.2 C72.2 R25.2 R27.1 R29.1 U8.A9(VSS1) U8.B1(VSSQ1) U8.B3(VSS2) U8.B9(VSSQ2) U8.D1(VSSQ3) U8.D8(VSSQ4) U8.E1(VSS3) U8.E2(VSSQ5) U8.E8(VSSQ6) U8.F9(VSSQ7) U8.G1(VSSQ8) U8.G8(VSS4) U8.G9(VSSQ9) U8.J2(VSS5) U8.J8(VSS6) U8.M1(VSS7) U8.M9(VSS8) U8.P1(VSS9) U8.P9(VSS10) U8.T1(VSS11) U8.T9(VSS12) ; also sheet 1,2,3,5,6,7,8,9,10,11,13
VDDS_DDR: C57.1 C58.1 C59.1 C60.1 C61.1 C62.1 C63.1 C64.1 C65.1 C66.1 C67.1 C68.1 C69.1 C70.1 C71.1 C72.1 R26.1 R30.1 U8.A1(VDDQ1) U8.A8(VDDQ2) U8.B2(VDD1) U8.C1(VDDQ3) U8.C9(VDDQ4) U8.D2(VDDQ5) U8.D9(VDD9) U8.E9(VDDQ7) U8.F1(VDDQ8) U8.G7(VDD2) U8.H2(VDDQ9) U8.H9(VDDQ10) U8.K2(VDD4) U8.K8(VDD5) U8.N1(VDD6) U8.N9(VDD7) U8.R1(VDD8) U8.R9(VDD3) ; supply symbol labelled VCC ; also sheet 1,2,3,6
ZQ: R25.1 U8.L8(ZQ)
Unconnected: U8.J1(NC1) U8.J9(NC2) U8.L1(NC3) U8.L9(NC4)

### Notes on the sheet
- TILLE:
- BeagleBone DDR3 Memory
- Document Number: | REV:
- Date: | Sheet: 12/13

## Sheet 13 of 13
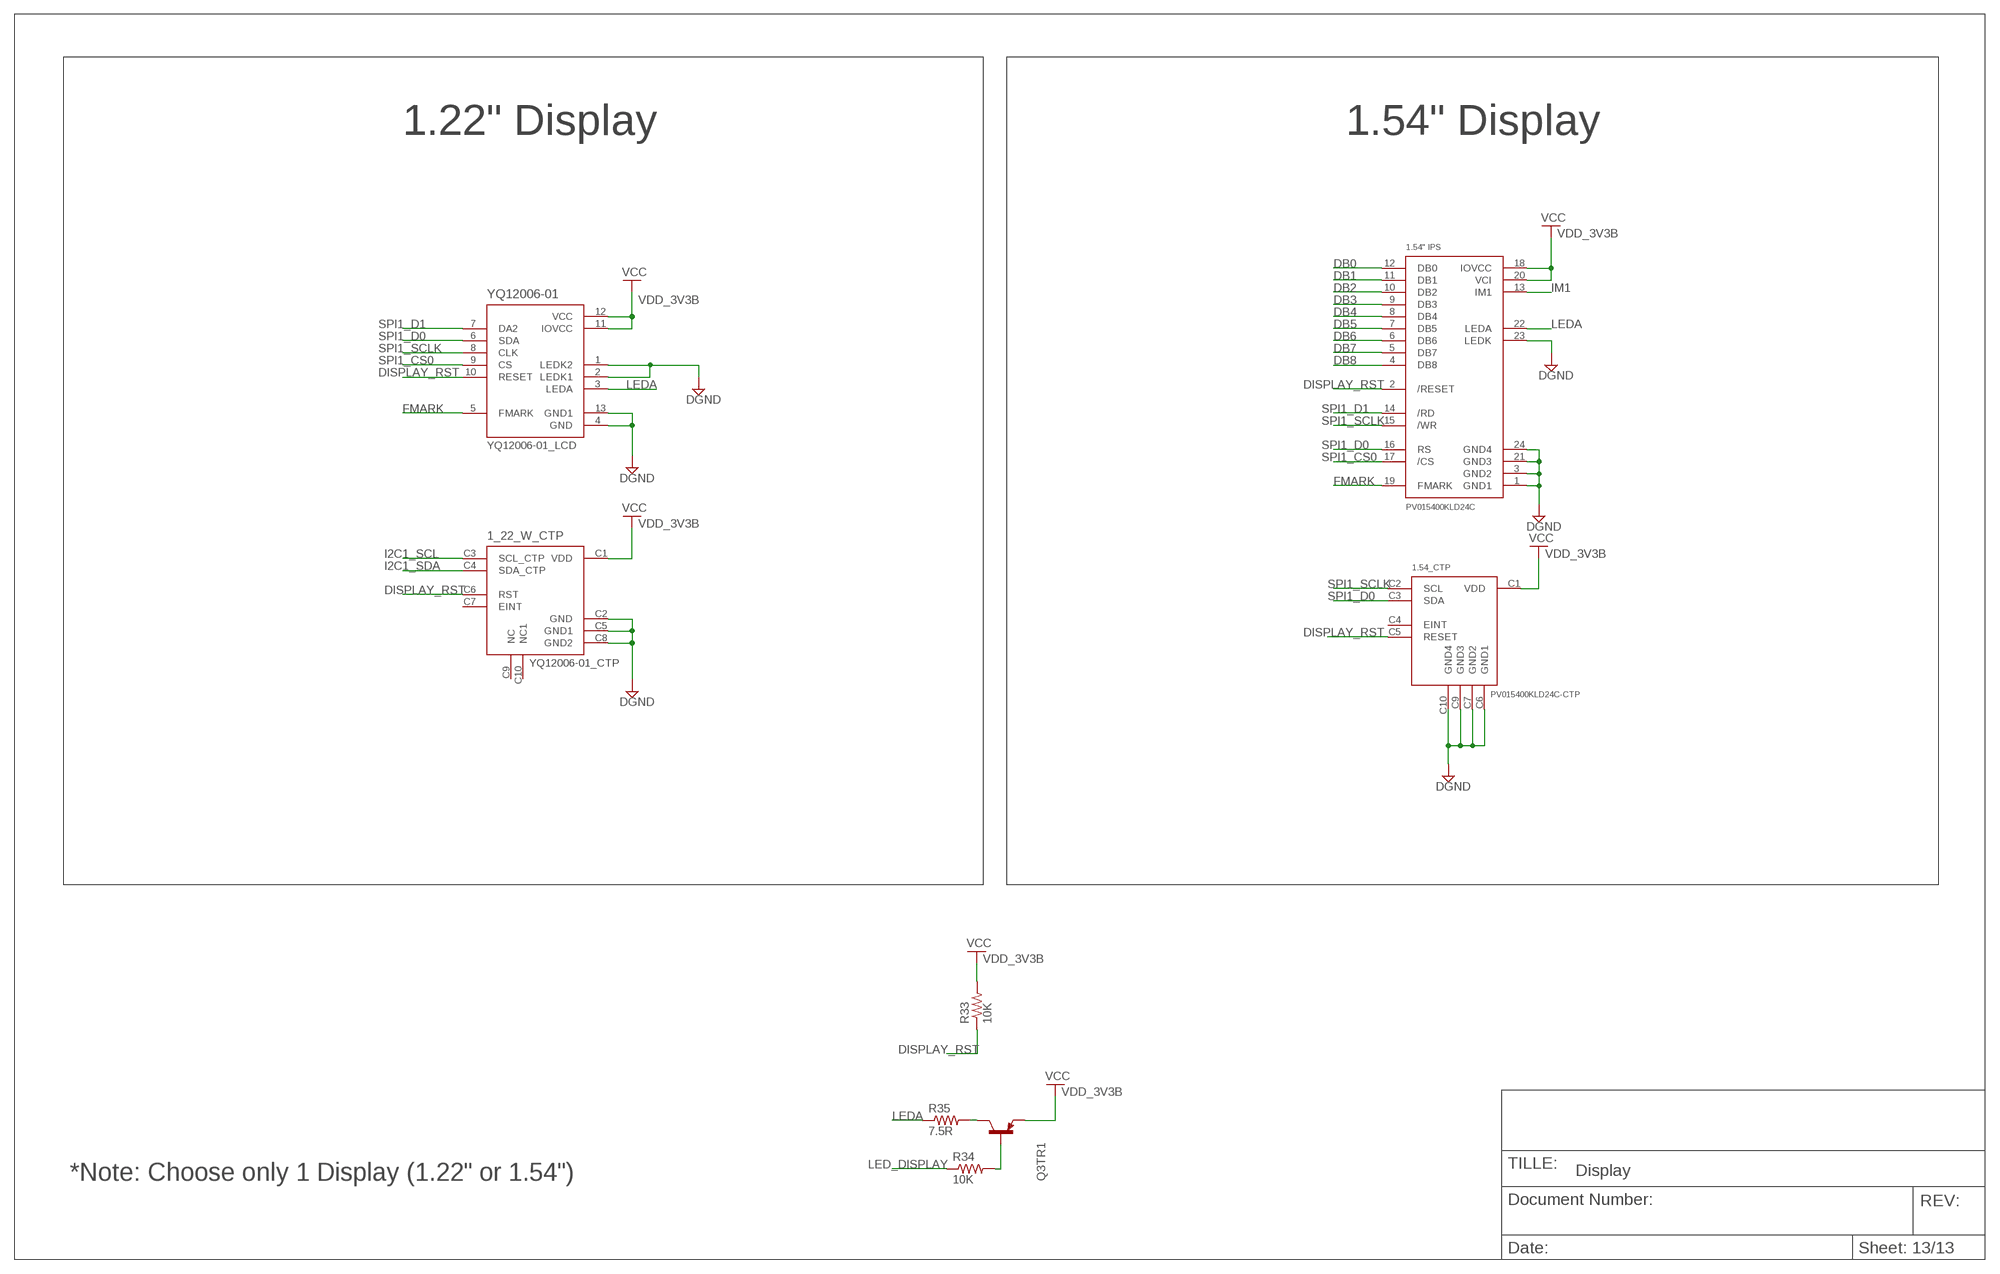
[diagram p14: schematic, sheet 13]

### Parts
DISPLAY1  DISPLAY_1_54_W_CTP  [PV015400KLD24C]
LCD1  DISPLAY_1_22_W_CTP  [YQ12006-01]
Q3  DME914C10R  [DMC56404]
R33  10K  R-US_R0402  [R0402]
R34  10K  R-US_R0402  [R0402]
R35  7.5R  R-US_R0402  [R0402]

### Nets
DB0: DISPLAY1.12(DB0) ; also sheet 4,10
DB1: DISPLAY1.11(DB1) ; also sheet 4,10
DB2: DISPLAY1.10(DB2) ; also sheet 4,10
DB3: DISPLAY1.9(DB3) ; also sheet 4,10
DB4: DISPLAY1.8(DB4) ; also sheet 4,10
DB5: DISPLAY1.7(DB5) ; also sheet 4,10
DB6: DISPLAY1.6(DB6) ; also sheet 4,10
DB7: DISPLAY1.5(DB7) ; also sheet 4,10
DB8: DISPLAY1.4(DB8) ; also sheet 4,10
DGND: DISPLAY1.1(GND1) DISPLAY1.3(GND2) DISPLAY1.21(GND3) DISPLAY1.23(LEDK) DISPLAY1.24(GND4) DISPLAY1.C6(GND1) DISPLAY1.C7(GND2) DISPLAY1.C9(GND3) DISPLAY1.C10(GND4) LCD1.1(LEDK2) LCD1.2(LEDK1) LCD1.4(GND) LCD1.13(GND1) LCD1.C2(GND) LCD1.C5(GND1) LCD1.C8(GND2) ; also sheet 1,2,3,5,6,7,8,9,10,11,12
DISPLAY_RST: DISPLAY1.2(/RESET) DISPLAY1.C5(RESET) LCD1.10(RESET) LCD1.C6(RST) R33.1 ; also sheet 4,10
FMARK: DISPLAY1.19(FMARK) LCD1.5(FMARK) ; also sheet 4,10
I2C1_SCL: LCD1.C3(SCL_CTP) ; also sheet 4,10
I2C1_SDA: LCD1.C4(SDA_CTP) ; also sheet 4,10
IM1: DISPLAY1.13(IM1) ; also sheet 4,10
LED_DISPLAY: R34.1 ; also sheet 3,10
LEDA: DISPLAY1.22(LEDA) LCD1.3(LEDA) R35.1
N$11: Q3.2(TR1:B) R34.2
N$18: Q3.6(TR1:C) R35.2
SPI1_CS0: DISPLAY1.17(/CS) LCD1.9(CS) ; also sheet 4,10,11
SPI1_D0: DISPLAY1.16(RS) DISPLAY1.C3(SDA) LCD1.6(SDA) ; also sheet 4,10,11
SPI1_D1: DISPLAY1.14(/RD) LCD1.7(DA2) ; also sheet 4,10
SPI1_SCLK: DISPLAY1.15(/WR) DISPLAY1.C2(SCL) LCD1.8(CLK) ; also sheet 4,10,11
VDD_3V3B: DISPLAY1.18(IOVCC) DISPLAY1.20(VCI) DISPLAY1.C1(VDD) LCD1.11(IOVCC) LCD1.12(VCC) LCD1.C1(VDD) Q3.1(TR1:E) R33.2 ; supply symbol labelled VCC ; also sheet 1,4,6,7,8,9,10,11
Unconnected: DISPLAY1.C4(EINT) LCD1.C7(EINT) LCD1.C9(NC) LCD1.C10(NC1) Q3.3(TR2:C1) Q3.4(TR2:E1) Q3.5(TR2:B1)

### Notes on the sheet
- 1.22" Display | 1.54" Display
- TILLE:
- *Note: Choose only 1 Display (1.22" or 1.54") | Display
- Document Number: | REV:
- Date: | Sheet: 13/13

## Library data of the parts
C1-C72 C100-C125 C130-C132 C134 C135 C159 C160 C163 C165-C231 = rcl:C-EU: CAPACITOR, European symbol
C126-C129 = capacitor-wima:C: CAPACITOR naming: grid - package width
C133 = m-pad-2-1:C_US: Capacitors in various packages
C136-C158 C161 C162 C164 C613 = dp_devices:CAP
D1 = m-pad-2.1:LED: LED's in various packages
D2-D5 = led:*_T679-?-1: LC TOPLED® Low Current LED Source: http://catalog.osram-os.com .. LG_LS_LY_T679_OBS.pdf; COLOR: green
D6 D7 = nxp:IP4283CZ10: TVS ARRAY, SEMTECH
D8 = nxp_60_1_1:RB751: Schottky barrier single diode Planar Schottky barrier single diodes with an integrated guard ring for stress protection, encapsulated in small Surface-Mounted Device (SMD) plastic packages. AAL Eindhoven MK
DISPLAY1 = Kingtech Group Displays:DISPLAY_1_54_W_CTP: 1.54" IPS DISPLAY
FB1 FB4-FB10 L4 = rcl:L-US: INDUCTOR, American symbol
H1-H4 = holes:MOUNT-PAD-ROUND: MOUNTING PAD, round
IC1 = texas:AM335X_ZCZ: IC MPU SITARA; DIGIKEY: 296-35869-5-ND; MF: Texas Instruments; MPN: AM3358BZCZ100
IC2 = texas:TPS773*: 250-mA LDO REGULATORS WITH RESET OUTPUT WITH 8-PIN MSOP PACKAGING Source: http://focus.ti.com/lit/ds/symlink/tps77333.pdf; DIGIKEY: 296-8108-5-ND; MF: TEXAS INSTRUMENT CONNECTORS; MPN: TPS77301DGK
L1-L3 = rcl:L-EU: INDUCTOR, European symbol
LCD1 = Kingtech Group Displays:DISPLAY_1_22_W_CTP: TFT LCD MODULE (1.22 inch 240RGB*204DOTS) MODULE NUMBER: YQ12006-01; MF: KINGTECH
P1 = con-fci:10118242-001RLF: HDMI Type D Receptacle; MF: FCI; MPN: 10118242-001RLF
P2 = m-pad-2-1:CON-MINI_USB-A: USB - mini A Receptacle Connector 5 Position Surface Mount, Right Angle, Horizontal; DIGIKEY: A123107-ND; MF: TE Connectivity AMP Connectors; MPN: 1734327-1
P3 = con-hirose:MINI-USB-SHIELD-: MINI USB Connector Source: http://www.hirose.co.jp/cataloge_hp/e24000019.pdf; OC_FARNELL: unknown; OC_NEWARK: unknown
P4 = con-molex-microsd:MICROSD_SD_MODE: MOLEX - 49225-0821 - CONN MICRO SD CARD PUSH-PUSH R/A; MANUFACTURER: Molex, LLC; MPN: 0492250821; REFERENCE: http://www.molex.com/pdm_docs/sd/492250821_sd.pdf; SUPPLIER_PN: WM3295CT-ND
P5 = Wurth_Elektronik_Electromechanic_DC_Power_Jack_Connectors_rev15c:694106301002: WR-DC_DC Power Jack_Right Angled_THT Center Pin Ø2.0_Plug ID Ø2.05_Plug OD Ø5.5 ;=>Code : Con_WR-DC_THT_694108301002_694106301002 <http://katalog.we-online.de/media/images/eican/Con_WR-DC_THT_694108301002_pf2.jpg> Details see: http://katalog.we-online.de/em/datasheet/6941xx301002.pdf Created 2014-10-08, Karrer Zheng 2014 (C) Wurth Elektronik
P6 = con-lsta:FE05-2: FEMALE HEADER; OC_FARNELL: unknown; OC_NEWARK: unknown
P7 = m-pad-2-1:JTAG: 10 Position Receptacle Connector 0.079" (2.00mm) Surface Mount Gold; DIGIKEY: WM18700-ND; MF: Molex, LLC; MPN: 0791091004
P8 P9 = con-lsta:FE25-2: FEMALE HEADER; OC_FARNELL: unknown; OC_NEWARK: unknown
P10 = Wurth_Elektronik_Passive_rev15d:WE-RJ45-LAN-10/100BT-7499010211A: Order Code 7499010211A Design THT xBase-T 10/100 Base-T Ports 1x1 Application Standard Tab Position DOWN LED (Left-Right) Green-Yellow EMI Fingers No <http://katalog.we-online.de/media/images/eisos/UtLAN_RJ45_pf2.jpg> Details see: http://katalog.we-online.de/en/pbs/WE-LAN_RJ45/7499010211A? Updated by Dan Xu 2014-07-11 2014 (C) Würth Elektronik; COMPANY-URL: http://www.we-online.de; CREATED-BY: Christin Zierenner; CREATED-DATE: AUG 2012; DATASHEET-URL: http://katalog.we-online.de/kataloge/eisos/media/pdf/7499010211A.pdf; MANUFACTURER: Würth Elektronik eiSos GmbH
Q1 Q2 = beagleboard10:DMC56404: TRANS PREBIAS DUAL NPN SMINI6; DIGIKEY: DMC564040RCT-ND; MF: Panasonic Electronic Components; MPN: DMC564040R
Q3 = beagleboard10:DME914C10R
R1-R35 R77 R78 R80-R140 R142 R144-R217 R219 R220 R222-R283 = rcl:R-US_: RESISTOR, American symbol
RT1 = ptc-ntc:PTC660A: PHILIPS PTC; OC_FARNELL: unknown; OC_NEWARK: unknown
S1 = switch-omron:B3U-1100P: SMD Tactile Switch - Ultra Small
TP1-TP4 TP7-TP18 = testpad:TP: Test pad
U1 = beagleboard:NCP349: IC VOLTAGE DETECTOR OVP 6DFN; DIGIKEY: NCP349MNBKTBGOSCT-ND; MF: ON Semiconductor; MPN: NCP349MNBKTBG
U2 = beagleboard:TPS65217B: IC PMIC BATTERY 48VQFN; DIGIKEY: 296-40879-1-ND; MF: Texas Instruments; MPN: TPS65217BRSLR
U3 = PHUONGBEAGLEBONE_06Nov12:(EEPROM)93C46BT-I/OT; DIGIKEY: 93C46BT-I/OTCT-ND; MF: Microchip Technology; MPN: 93C46BT-I/OT
U4 = beagleboard9:SN74AUP2G08,DNI: AND Gate IC 2 Channel 8-X2SON (1.4x1.0); DIGIKEY: 296-25638-1-ND; MF: Texas Instruments; MPN: SN74AUP2G08DQER
U5 = nxp:TDA19988BHN/C1,557: IC HDMI TRANSMITTER 64-HVQFN; DIGIKEY: 568-12059-ND; MF: NXP Semiconductors; MPN: TDA19988BHN/C1,557
U6 = beagleboard12:MT47H128M16RT-25E:C: IC DDR2 SDRAM 2GBIT 2.5NS 84FBGA; DIGIKEY: 557-1535-ND; MF: Micron Technology Inc.; MPN: MT47H128M16RT-25E:C
U7 = beagleboard13:CAT24C256W: IC EEPROM 256KBIT 400KHZ 8SOIC; DIGIKEY: CAT24C256WI-GT3OSCT-ND; MF: ON Semiconductor; MPN: CAT24C256WI-GT3
U8 = beagleboard12:AS4C256M16D3L: IC SDRAM DDR3 256M X 16 96-FBGA; DIGIKEY: 1450-1097-ND; MF: Alliance Memory, Inc.; MPN: AS4C256M16D3L-12BCN
U9 = beagleboard6:TPS2051(DGN): IC 0.5A POWER DIST SW 8-MSOP; DIGIKEY: 296-17313-1-ND; MF: Texas Instruments; MPN: TPS2051BDGNR
U10 = beagleboard5:TPD4S012: IC 4CH ESD SOLUTION W/CLAMP 6SON; DIGIKEY: 296-24244-1-ND; MF: Texas Instruments; MPN: TPD4S012DRYR
U11 = beagleboard4:USB2412_QFN28
U12 = DP-EagleLibrary:FT2232H: IC USB HS DUAL UART/FIFO; DIGIKEY: 768-1025-1-ND; MF: FTDI, Future Technology Devices International Ltd; MPN: FT2232HQ-REEL
U14 = beagleboard1:SN74LVC2G00DCU: NAND Gate IC 2 Channel; DIGIKEY: 296-13258-1-ND; MF: Texas Instruments; MPN: SN74LVC2G00DCUR
U15 = BPPP:LAN8710A: IC TXRX ETHERNET 32QFN; DIGIKEY: LAN8710A-EZC-CT-ND; MF: Microchip Technology; MPN: LAN8710A-EZC-TR
U16 = beagleboard3:SN74LVC2G07DCK: IC BUFF/DVR DL NON-INV SC706; DIGIKEY: 296-13495-1-ND; MF: Texas Instruments; MPN: SN74LVC2G07DCKR
Y4 = crystal:CRYSTAL: CRYSTAL; OC_FARNELL: 1667008; OC_NEWARK: unknown
Y5 Y8 Y9 = m-pad-2-1:CTS-CRYSTALS: CTS 405/406 Ceramic - SM Crystal Description: The Model 406 is a ceramic packaged Crystal offering reduced size, ideal for high-density circuit board applications. The Model 406 offers reliable precision and excellent shock performance in wireless telecommunication devices. FEATURES: 405: Standard 5.0x3.2mm Surface Mount Footprint. 406: Standard 6.0x3.5mm Surface Mount Footprint Stable Frequency Over Temperature and Drive Level 405: Frequency Range 12 - 50 MHz 406: Frequency Range 10 - 50 MHz Frequency Tolerance, ±30 ppm Standard (±10 ppm and ±20 ppm available) Frequency Stability, ±50 ppm Standard (±10,±20,±30 and ±40 ppm available) Operating Temperature to -40°C to +85°C Tape & Reel Packaging, EIA-481-2 Compliant RoHS Compliant APPLICATIONS: Surface mount 3.5 x 6.0mm x 1.2mm Max. crystal is ideal for application to high-density circuit boards with reliable precision & excellent shock performance in wireless telecommunications devices. Please send any comments to: messi@users.sourceforge.net; DIGIKEY: CTX1198CT-ND; MF: CTS-Frequency Controls; MPN: 405I35D24M00000
Y6 = dp_devices:CRYSTAL_2
Y7 = crystal:CRYSTAL: CRYSTAL